# Altium schematic sheet 16-ESP32S3.SchDoc
size B; SheetNumber: 16; SheetTotal: 16
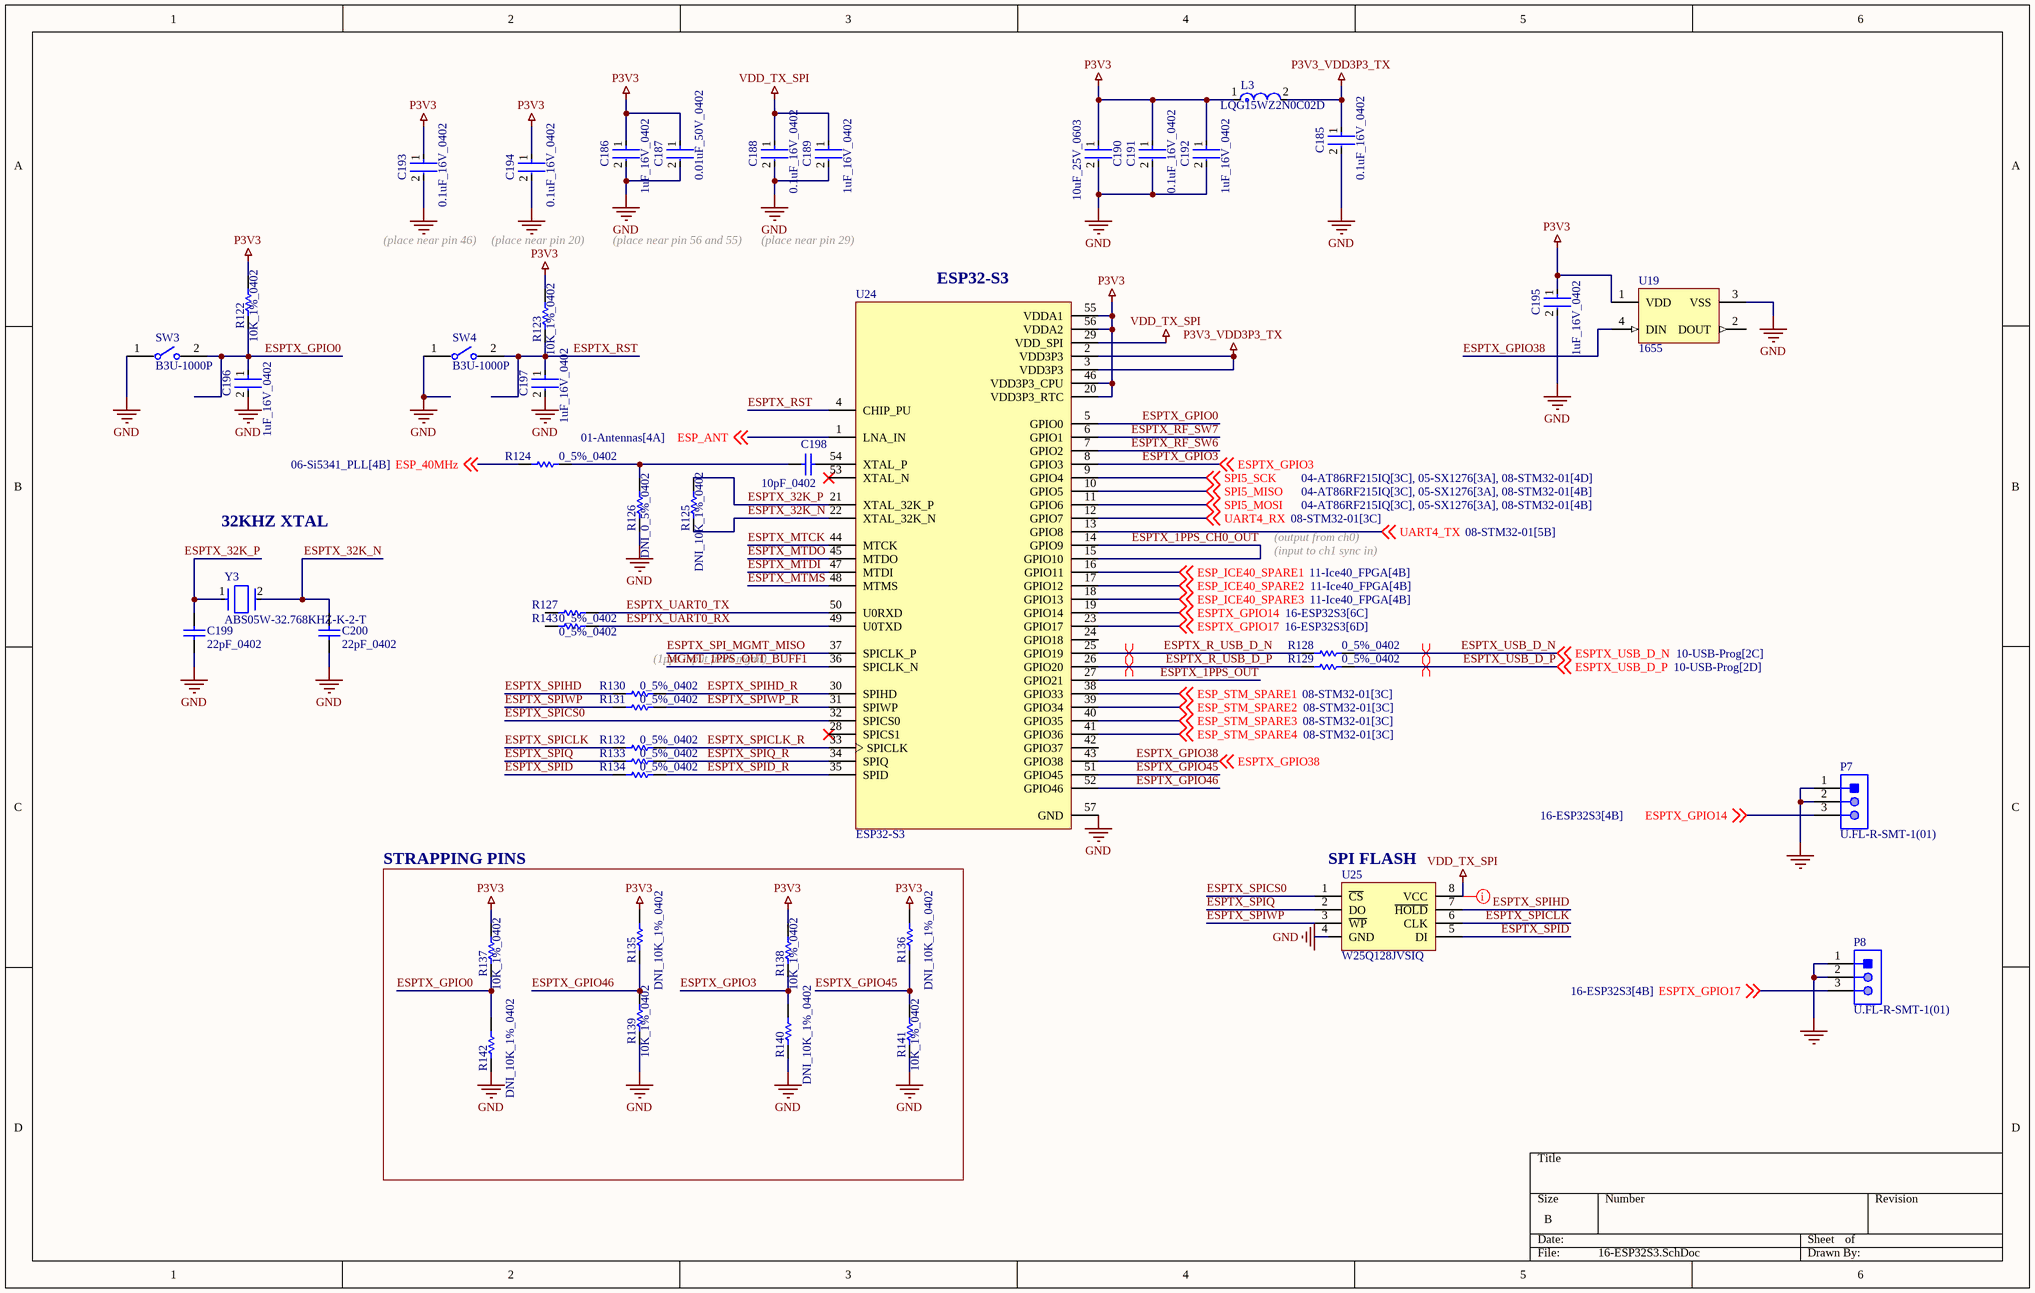
[diagram p0: 16-ESP32S3.SchDoc]

## Parts
C185  0.1uF_16V_0402  [FP-C0402-BB-MFG]
C186  1uF_16V_0402  [FP-0402-L_1_0_0_05-W_0_5-IPC_A]
C187  0.01uF_50V_0402  [FP-GCM155-0_05-IPC_C]
C188  0.1uF_16V_0402  [FP-C0402-BB-MFG]
C189  1uF_16V_0402  [FP-0402-L_1_0_0_05-W_0_5-IPC_A]
C190  10uF_25V_0603  [FP-CL10-IPC_C]
C191  0.1uF_16V_0402  [FP-C0402-BB-MFG]
C192  1uF_16V_0402  [FP-0402-L_1_0_0_05-W_0_5-IPC_A]
C193  0.1uF_16V_0402  [FP-C0402-BB-MFG]
C194  0.1uF_16V_0402  [FP-C0402-BB-MFG]
C195  1uF_16V_0402  [FP-0402-L_1_0_0_05-W_0_5-IPC_A]
C196  1uF_16V_0402  [FP-0402-L_1_0_0_05-W_0_5-IPC_A]
C197  1uF_16V_0402  [FP-0402-L_1_0_0_05-W_0_5-IPC_A]
C198  10pF_0402  [CAPC1005X55X25ML05T05]
C199  22pF_0402  [CAPC1005X55X25ML05T05]
C200  22pF_0402  [CAPC1005X55X25ML05T05]
L3  LQG15WZ2N0C02D  [FP-LQG15WH_02-IPC_B]
P7  U.FL-R-SMT-1(01)  [HRS-U.FL-R-SMT-3_V]
P8  U.FL-R-SMT-1(01)  [HRS-U.FL-R-SMT-3_V]
R122  10K_1%_0402  [RESC1005X40X25NL10T10]
R123  10K_1%_0402  [RESC1005X40X25NL10T10]
R124  0_5%_0402  [RESC1005X40X25NL05T10]
R125  DNI_10K_1%_0402  [RESC1005X40X25NL10T10]  (no BOM)
R126  DNI_0_5%_0402  [RESC1005X40X25NL05T10]  (no BOM)
R127  0_5%_0402  [RESC1005X40X25NL05T10]
R128  0_5%_0402  [RESC1005X40X25NL05T10]
R129  0_5%_0402  [RESC1005X40X25NL05T10]
R130  0_5%_0402  [RESC1005X40X25NL05T10]
R131  0_5%_0402  [RESC1005X40X25NL05T10]
R132  0_5%_0402  [RESC1005X40X25NL05T10]
R133  0_5%_0402  [RESC1005X40X25NL05T10]
R134  0_5%_0402  [RESC1005X40X25NL05T10]
R135  DNI_10K_1%_0402  [RESC1005X40X25NL10T10]  (no BOM)
R136  DNI_10K_1%_0402  [RESC1005X40X25NL10T10]  (no BOM)
R137  10K_1%_0402  [RESC1005X40X25NL10T10]
R138  10K_1%_0402  [RESC1005X40X25NL10T10]
R139  10K_1%_0402  [RESC1005X40X25NL10T10]
R140  DNI_10K_1%_0402  [RESC1005X40X25NL10T10]  (no BOM)
R141  10K_1%_0402  [RESC1005X40X25NL10T10]
R142  DNI_10K_1%_0402  [RESC1005X40X25NL10T10]  (no BOM)
R143  0_5%_0402  [RESC1005X40X25NL05T10]
SW3  B3U-1000P  [FP-B3U-1000P-MFG]
SW4  B3U-1000P  [FP-B3U-1000P-MFG]
U19  1655  [ADA-RGB-1655_V]
U24  ESP32-S3  [IC_ESP32-S3]
U25  W25Q128JVSIQ  [IC_W25Q128JVSIQ]
Y3  ABS05W-32.768KHZ-K-2-T  [FP-ABS05W-MFG]

## Blocks framed on the sheet
STRAPPING PINS: R135-R142

## Nets
GND: C185.2 C186.2 C187.2 C188.2 C189.2 C190.2 C191.2 C192.2 C193.2 C194.2 C195.2 C196.2 C197.2 C199.1 C200.1 P7.1 P7.2 P8.1 P8.2 R126.1 R139.1 R140.1 R141.1 R142.1 SW3.1 SW4.1 U19.3(VSS) U24.57(GND) U25.4(GND)
P3V3: C186.1 C187.1 C190.1 C191.1 C192.1 C193.1 C194.1 C195.1 L3.1 R122.2 R123.2 R135.2 R136.2 R137.2 R138.2 U19.1(VDD) U24.20(VDD3P3_RTC) U24.46(VDD3P3_CPU) U24.55(VDDA1) U24.56(VDDA2)
P3V3_VDD3P3_TX: C185.1 L3.2 U24.2(VDD3P3) U24.3(VDD3P3)
VDD_TX_SPI: C188.1 C189.1 U24.29(VDD_SPI) U25.8(VCC)
ESP_40MHz: R124.1 ; off-sheet ESP_40MHz
ESP_ANT: U24.1(LNA_IN) ; off-sheet ESP_ANT
ESP_ICE40_SPARE1: U24.16(GPIO11) ; off-sheet ESP_ICE40_SPARE1
ESP_ICE40_SPARE2: U24.17(GPIO12) ; off-sheet ESP_ICE40_SPARE2
ESP_ICE40_SPARE3: U24.18(GPIO13) ; off-sheet ESP_ICE40_SPARE3
ESP_STM_SPARE1: U24.38(GPIO33) ; off-sheet ESP_STM_SPARE1
ESP_STM_SPARE2: U24.39(GPIO34) ; off-sheet ESP_STM_SPARE2
ESP_STM_SPARE3: U24.40(GPIO35) ; off-sheet ESP_STM_SPARE3
ESP_STM_SPARE4: U24.41(GPIO36) ; off-sheet ESP_STM_SPARE4
ESPTX_1PPS_CH0_OUT: U24.14(GPIO9) U24.15(GPIO10)
ESPTX_1PPS_OUT: U24.27(GPIO21)
ESPTX_32K_N: C200.2 R125.1 U24.22(XTAL_32K_N) Y3.2
ESPTX_32K_P: C199.2 R125.2 U24.21(XTAL_32K_P) Y3.1
ESPTX_GPIO0: C196.1 R122.1 R137.1 R142.2 SW3.2 U24.5(GPIO0)
ESPTX_GPIO3: R138.1 R140.2 U24.8(GPIO3) ; off-sheet ESPTX_GPIO3
ESPTX_GPIO14: P7.3 U24.19(GPIO14) ; off-sheet ESPTX_GPIO14
ESPTX_GPIO17: P8.3 U24.23(GPIO17) ; off-sheet ESPTX_GPIO17
ESPTX_GPIO38: U19.4(DIN) U24.43(GPIO38) ; off-sheet ESPTX_GPIO38
ESPTX_GPIO45: R136.1 R141.2 U24.51(GPIO45)
ESPTX_GPIO46: R135.1 R139.2 U24.52(GPIO46)
ESPTX_MTCK: U24.44(MTCK)
ESPTX_MTDI: U24.47(MTDI)
ESPTX_MTDO: U24.45(MTDO)
ESPTX_MTMS: U24.48(MTMS)
ESPTX_R_USB_D_N: R128.1 U24.25(GPIO19)
ESPTX_R_USB_D_P: R129.1 U24.26(GPIO20)
ESPTX_RF_SW6: U24.7(GPIO2)
ESPTX_RF_SW7: U24.6(GPIO1)
ESPTX_RST: C197.1 R123.1 SW4.2 U24.4(CHIP_PU)
ESPTX_SPI_MGMT_MISO: U24.37(SPICLK_P)
ESPTX_SPICLK: R132.1 U25.6(CLK)
ESPTX_SPICLK_R: R132.2 U24.33(SPICLK)
ESPTX_SPICS0: U24.32(SPICS0) U25.1(~{CS})
ESPTX_SPID: R134.1 U25.5(DI)
ESPTX_SPID_R: R134.2 U24.35(SPID)
ESPTX_SPIHD: R130.1 U25.7(~{HOLD})
ESPTX_SPIHD_R: R130.2 U24.30(SPIHD)
ESPTX_SPIQ: R133.1 U25.2(DO)
ESPTX_SPIQ_R: R133.2 U24.34(SPIQ)
ESPTX_SPIWP: R131.1 U25.3(~{WP})
ESPTX_SPIWP_R: R131.2 U24.31(SPIWP)
ESPTX_UART0_RX: R143.2 U24.49(U0TXD)
ESPTX_UART0_TX: R127.2 U24.50(U0RXD)
ESPTX_USB_D_N: R128.2 ; off-sheet ESPTX_USB_D_N
ESPTX_USB_D_P: R129.2 ; off-sheet ESPTX_USB_D_P
MGMT_1PPS_OUT_BUFF1: U24.36(SPICLK_N)
SPI5_MISO: U24.10(GPIO5) ; off-sheet SPI5_MISO
SPI5_MOSI: U24.11(GPIO6) ; off-sheet SPI5_MOSI
SPI5_SCK: U24.9(GPIO4) ; off-sheet SPI5_SCK
UART4_RX: U24.12(GPIO7) ; off-sheet UART4_RX
UART4_TX: U24.13(GPIO8) ; off-sheet UART4_TX
NetC198_1: C198.1 R124.2 R126.2
NetC198_2: C198.2 U24.54(XTAL_P)

Not connected (* = marked no-connect by the designer): R127 1; R143 1; U19 2(DOUT); U24 24(GPIO18) 28(SPICS1)* 42(GPIO37) 53(XTAL_N)*

## Layout directives
differential pair: ESPTX_R_USB_D_N, ESPTX_R_USB_D_P, ESPTX_USB_D_N, ESPTX_USB_D_P
net class Power: VDD_TX_SPI

## Notes on the sheet
- (place near pin 46)
- (place near pin 20)
- (place near pin 56 and 55)
- (place near pin 29)
- (near U24) ESP32-S3
- 32KHZ XTAL
- (input to ch1 sync in)
- (output from ch0)
- (1pps input from mgmt)
- (near U25) SPI FLASH

## Library data of the parts
C185 C188 C191 C193 C194 = CMP-1034-02068-3: CAP CER 0.1UF 16V 5% X7R 0402; Manufacturer: Kemet; Manufacturer Part Number: C0402C104J4RACTU; Value: 0.10 μF; Temperature Coefficient: 15%; Tolerance: 0.05; Material: Ceramic; ComponentLink2URL: https://content.kemet.com/datasheets/KEM_C1002_X7R_SMD.pdf; Automotive: No; Device Class L2: Capacitors; Temperature: -55°C to +125°C; RoHS: TRUE; Voltage Rating: 16 V; ComponentLink2Description: Datasheet; Device Class L3: Ceramic Capacitors; Temperature Range Low: -55°C; Ipc Land Pattern Name: CAPC10050X50; Device Class L1: Passive Components; Temperature Range High: +125°C; Package: C0402-BB; Capacitance: 0.10 μF; Category: Cap; Mouser Description: CAP CER 0.1UF 16V X7R 0402; Height: 0.55mm; Digikey Description: CAP CER 0.1UF 16V 5% X7R 0402; Octopart: https://octopart.com/c0402c104j4ractu-kemet-12573893; Temperature Characteristic: X7R; Lead Free: Yes
C186 C189 C192 C195-C197 = CMP-14477-000104-2: None; Tolerance: 10%; Voltage Rating: 16V; Dielectric: X5R; Capacitance: 1uF; Packaging: Tape and Reel; Depth: 0.5mm; Mount: Surface Mount; Thickness: 0.022inch; Package Quantity: 1; Min Operating Temperature: -55°C; Series: M; Voltage Rating (DC): 16V; Termination: SMD/SMT; Case/Package: 0402; Number of Pins: 2; Case Code (Imperial): 0402; Length: 1mm; Halogen Free: Halogen Free; Case Code (Metric): 1005; Width: 0.02inch; RoHS Compliant: Yes; Radiation Hardening: No; Max Operating Temperature: 85°C; Height: 0.5mm; Construction: Flat
C187 = CMP-2008-03723-3: Ceramic Capacitor for Automotive 10nF ±10% 50VDC X7R 0402 Paper T/R; Voltage Rating (DC): 50V; Min Operating Temperature: -55°C; Radiation Hardening: No; Mount: Surface Mount; Thickness: 0.022inch; Package Quantity: 1; Case Code (Imperial): 0402; Lead Free: Lead Free; Case/Package: 0402; Depth: 0.5mm; Termination: SMD/SMT; Tolerance: 10%; Voltage: 50V; Packaging: Tape and Reel; Width: 0.02inch; REACH SVHC: No SVHC; Height: 0.5mm; Max Operating Temperature: 125°C; Case Code (Metric): 1005; Voltage Rating: 50V; Capacitance: 10nF; Ratings: AEC-Q200; Length: 1mm; Dielectric: X7R
C190 = CMP-13271-004224-1: Cap Ceramic 10uF 25V X5R ±20% Pad SMD 0603 +85°C T/R; Width: 0.031inch; Voltage Rating: 25V; Length: 0.063inch; Case Code (Metric): 1608; Dielectric: X5R; Termination: Wraparound; Capacitance: 10uF; Lead Free: Lead Free; Mount: Surface Mount; Package Quantity: 1; Case Code (Imperial): 0603; Thickness: 0.035inch; Packaging: Tape and Reel; Contact Plating: Tin; Min Operating Temperature: -55°C; Tolerance: 20%; Max Operating Temperature: 85°C; Case/Package: 0603
C198 = CMP-2100-03589-1: Chip Capacitor, 10 pF, +/- 5%, 50 V, -55 to 125 degC, 0402 (1005 Metric), RoHS, Tape and Reel; Manufacturer: Yageo; Insulation Resistance: 100GR; Voltage Rating (DC): 50V; Dielectric Material: Ceramic; Temperature Coefficient: 30ppm/degC; Dielectric: C0G; Capacitance: 10pF; Termination: SMD/SMT; Package Reference: 0402; Lead Free: LeadFree; Composition: Ceramic; Tolerance: 5%; Case Code (Metric): 1005; Voltage Rating: 50V; Packaging: TapeandReel; Manufacturer URL: http://www.yageo.com/; REACH SVHC: NoSVHC; Max Operating Temperature: 125degC; Length: 1mm; Mount: SurfaceMount; Depth: 0.5mm; Min Operating Temperature: -55degC; Number of Pins: 2; Width: 0.02inch; Datasheet Version: Rev. 14, 07/2016; Package Quantity: 1; Datasheet URL: http://www.yageo.com/documents/recent/UPY-GP_NP0_16V-to-50V_14.pdf; Case Code (Imperial): 0402; RoHSCompliant: True; Radiation Hardening: No; Height: 0.5mm; Case/Package: 0402; Thickness: 0.022inch; Package Description: 2-Pin Surface Mount Device, Body 1 x 0.5 mm; Voltage: 50V
C199 C200 = CMP-2100-03590-1: Chip Capacitor, 22 pF, +/- 5%, 50 V, -55 to 125 degC, 0402 (1005 Metric), RoHS, Tape and Reel; Manufacturer: Yageo; Voltage Rating: 50V; Dielectric Material: Ceramic; Capacitance: 22pF; Temperature Coefficient: 30ppm/degC; Dielectric: C0G; Insulation Resistance: 100GR; Datasheet URL: http://www.yageo.com/NewPortal/yageodocoutput?fileName=/pdf/MLCC/UPY-GP_NP0_16V-to-50V_14.pdf; Depth: 0.5mm; Number of Pins: 2; Height: 0.5mm; Min Operating Temperature: -55degC; REACH SVHC: NoSVHC; Max Operating Temperature: 125degC; Voltage Rating (DC): 50V; Composition: Ceramic; Packaging: TapeandReel; Package Quantity: 1; Package Reference: 0402; Length: 1mm; Radiation Hardening: No; Package Description: 2-Pin Surface Mount Device, Body 1 x 0.5 mm; RoHSCompliant: True; Thickness: 0.022inch; Manufacturer URL: http://www.yageo.com/; Mount: SurfaceMount; Case Code (Metric): 1005; Case/Package: 0402; Tolerance: 5%; Termination: SMD/SMT; Width: 0.02inch; Datasheet Version: Rev. 14, 07/2016; Lead Free: LeadFree; Case Code (Imperial): 0402
L3 = CMP-06042-012509-1: Multilayer type Inductor for Automotive 2nH ±0.2nH 0.05Ω 1000mA 0402; Test Frequency: 100MHz; Shielding: Unshielded; DC Resistance (DCR): 50mR; Self Resonant Frequency: 8GHz; Current Rating: 1A; Core Material: Air; Case Code (Metric): 1005; Case/Package: 0402; Mount: Surface Mount; Min Operating Temperature: -55°C; Inductance: 2nH; Ratings: AEC-Q200; Max Operating Temperature: 125°C; Packaging: Cut Tape; Case Code (Imperial): 0402
P7 P8 = CMP-2000-05153-1: Ultra Small Coaxial Connector, 6 GHz, -40 to 90 degC, 3-Pin SMD, RoHS, Bulk; Manufacturer: Hirose Electric; Connector Style: U.FL; Impedance: 50Ohm; Dielectric Material: LiquidCrystalPolymer(LCP); Minimum Quantity: UltraMiniatureCoaxial; Online Catalog: U.FLSeries; Featured Product: HiroseU.FLSeries; Frequency - Max: 6GHz; Other Names: H122041 / U.FL-R-SMT-1(01)-ND; Contact Termination: Solder; Body Material: PhosphorBronze; Connector Type: Jack,MalePin; Body Finish: Silver; Center Contact Plating: Gold; Manufacturer URL: https://www.hirose.com; Family: CoaxialConnectors(RF); Fastening Type: Snap-On; Unit PriceUSD: U.FL; Series: U.FL; Package Reference: U.FL-R-SMT; Packaging: Bulk; Standard Package: 100; Mounting Type: SurfaceMount; Quantity Available: Bulk; Housing Color: Silver; Package Description: 3-Pin Surface Mount Device, Body 2.6 x 2.6 mm; Category: Connectors,Interconnects; Operating Temperature: -40degC~90degC; Center Contact Material: PhosphorBronze; Dynamic Catalog: U.FLSeries; Datasheet URL: https://datasheet.ciiva.com/26945/getdatasheetpartid-475239-26945414.pdf; Datasheet Version: Feb-09; Shield Termination: Solder
R122 R123 R125 R135-R142 = CMP-2002-04694-1: Manufacturer: Bourns; Part Number: CR0402-FX-1002GLF
R124 R126-R134 R143 = CMP-2002-06457-1: Manufacturer: Panasonic; Part Number: ERJ-U020R00X
SW3 SW4 = CMP-2100-03586-2: SWITCH TACTILE SPST-NO 0.05A 12V; Contact Resistance: 100mR; Operating Force: 1.5N; Max Current Rating: 50mA; Switch Travel: 0.15mm; Actuator Type: Standard; Mechanical Life: 200000Cycles; Ratings: Dust Proof; Illumination Type: Non-Illuminated; Throw Configuration: SPST; Actuator Length: 0.4mm; Switch Function: Off-Mom; Height: 1.2mm; Width: 3mm; Weight: 0.000776oz; Contact Material: Silver; Max Voltage Rating (DC): 12V; Insulation Resistance: 100MR; Lead Free: Lead Free; Current Rating: 50mA; Termination: SMD/SMT; Length: 4mm; Voltage Rating (DC): 12V; Contact Current Rating: 50mA; Orientation: Straight; Depth: 2.5mm; Max Operating Temperature: 70°C; Packaging: Tape and Reel; Min Operating Temperature: -25°C; Package Quantity: 1; Mount: Surface Mount; Electrical Life: 200000Cycles
U19 = CMP-2000-05026-1: Intelligent Control LED Integrated Light Source, 3.5 to 5.3 V, -25 to 80 degC, 4-Pin SMD, RoHS, Tape and Reel; Manufacturer: Adafruit-Industries-LLC; Number of LEDs: 10; Configuration: Discrete; Utilized LED: WS2812(5050); Datasheet URL: http://datasheet.octopart.com/ADA1655-Adafruit-Industries-datasheet-32028139.pdf; Series: Neopixel; Interface: -; Package Description: 4-Pin Surface Mount Device, Body 5 x 5 mm; Color: Red,Green,Blue(RGB); Category: Optoelectronics; Controller Type: -; Package Reference: 1655; Manufacturer URL: https://www.adafruit.com/; Mounting Type: SurfaceMount; Datasheet Version: May-13; Size / Dimension: 5.00mmLx5.00mmW; Family: Addressable,Specialty
U24 = IC_ESP32-S3: IC RF TxRx + MCU Bluetooth, WiFi 802.11b/g/n, Bluetooth v5.0 2.412GHz ~ 2.484GHz 56-VFQFN Exposed Pad; MF: Espressif Systems; Check_prices: https://www.snapeda.com/parts/ESP32-S3/Espressif+Systems/view-part/?ref=eda; Purchase-URL: https://pricing.snapeda.com/search/part/ESP32-S3/?ref=eda; Value: *; Availability: In Stock; Package: None; SnapEDA_Link: https://www.snapeda.com/parts/ESP32-S3/Espressif+Systems/view-part/?ref=snap; MP: ESP32-S3; Price: None; Supplier 1: LCSC; Supplier Part Number 1: C2913192
U25 = IC_W25Q128JVSIQ: NOR Flash Serial (SPI, Dual SPI, Quad SPI) 3.3V 128M-bit 16M x 8 6ns 8-Pin SOIC Tube; Manufacturer: Winbond; Memory Format: Non-Volatile,FLASH; Frequency: 133MHz; Memory Size: 128Mb; Supplier 1: Digi-Key; Manufacturer Part Number: W25Q128JVSIQ; RoHS: Yes; Category: Flash; Stock 1: 154352; Pricing 1: 1=1.71, 10=1.562, 25=1.52, 50=1.5124, 100=1.3519, 250=1.348, 500=1.32762, 1000=1.27127, 5000=1.18359 (USD); Mounting Technology: Surface Mount; Case/Package: SOIC; Min Operating Temperature: -40°C; Max Operating Temperature: 85°C; Packaging: Tray; Series: SpiFlash®; RoHS Compliant: Yes; ComponentLink1URL: http://www.winbond.com/resource-files/w25q128jv%20revf%2003272018%20plus.pdf?src-supplier=Digi-Key; ComponentLink1Description: http://www.winbond.com/resource-files/w25q128jv%20revf%2003272018%20plus.pdf?src-supplier=Digi-Key; Supplier Part Number 1: W25Q128JVSIQ-ND
Y3 = CMP-27762-015607-1: Crystal 32.768kHz ±20ppm (Tol) 4pF 85kΩ 2-Pin SMD T/R; ESR (Equivalent Series Resistance): 85kR; Frequency Tolerance: 20ppm; Mount: Surface Mount; Load Capacitance: 4pF; Case/Package: SMD/SMT; Packaging: Cut Tape; Frequency: 32.768kHz; Series: ABS05W; Min Operating Temperature: -40°C; Max Operating Temperature: 125°C